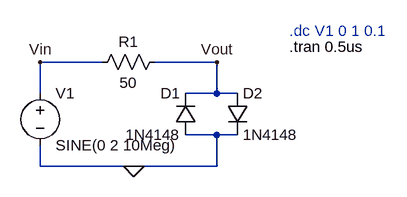
[diagram p0: schematic Limiter.asc]
Limiter.asc, the LTspice schematic file:
Version 4
SHEET 1 880 680
WIRE 336 272 240 272
WIRE 512 272 416 272
WIRE 240 320 240 272
WIRE 512 320 512 272
WIRE 512 320 464 320
WIRE 544 320 512 320
WIRE 512 384 464 384
WIRE 544 384 512 384
WIRE 240 432 240 400
WIRE 384 432 240 432
WIRE 512 432 512 384
WIRE 512 432 384 432
FLAG 384 432 0
FLAG 512 272 Vout
FLAG 240 272 Vin
SYMBOL Voltage 240 304 R0
SYMATTR InstName V1
SYMATTR Value SINE(0 2 10Meg)
SYMBOL Res 432 256 R90
WINDOW 0 0 56 VBottom 2
WINDOW 3 32 56 VTop 2
SYMATTR InstName R1
SYMATTR Value 50
SYMBOL diode 480 384 R180
WINDOW 0 24 64 Left 2
WINDOW 3 24 0 Left 2
SYMATTR InstName D1
SYMATTR Value 1N4148
SYMBOL diode 528 320 R0
SYMATTR InstName D2
SYMATTR Value 1N4148
TEXT 624 224 Left 2 ;.dc V1 0 1 0.1
TEXT 624 248 Left 2 !.tran 0.5us

The netlist it stands for:
* Limiter.asc
V1 Vin 0 SINE(0 2 10Meg)
R1 Vout Vin 50
D1 0 Vout 1N4148
D2 Vout 0 1N4148
.model D D
.lib standard.dio
* .dc V1 0 1 0.1
.tran 0.5us
.backanno
.end